# Altium schematic sheet Microcontroller.SchDoc
size A4
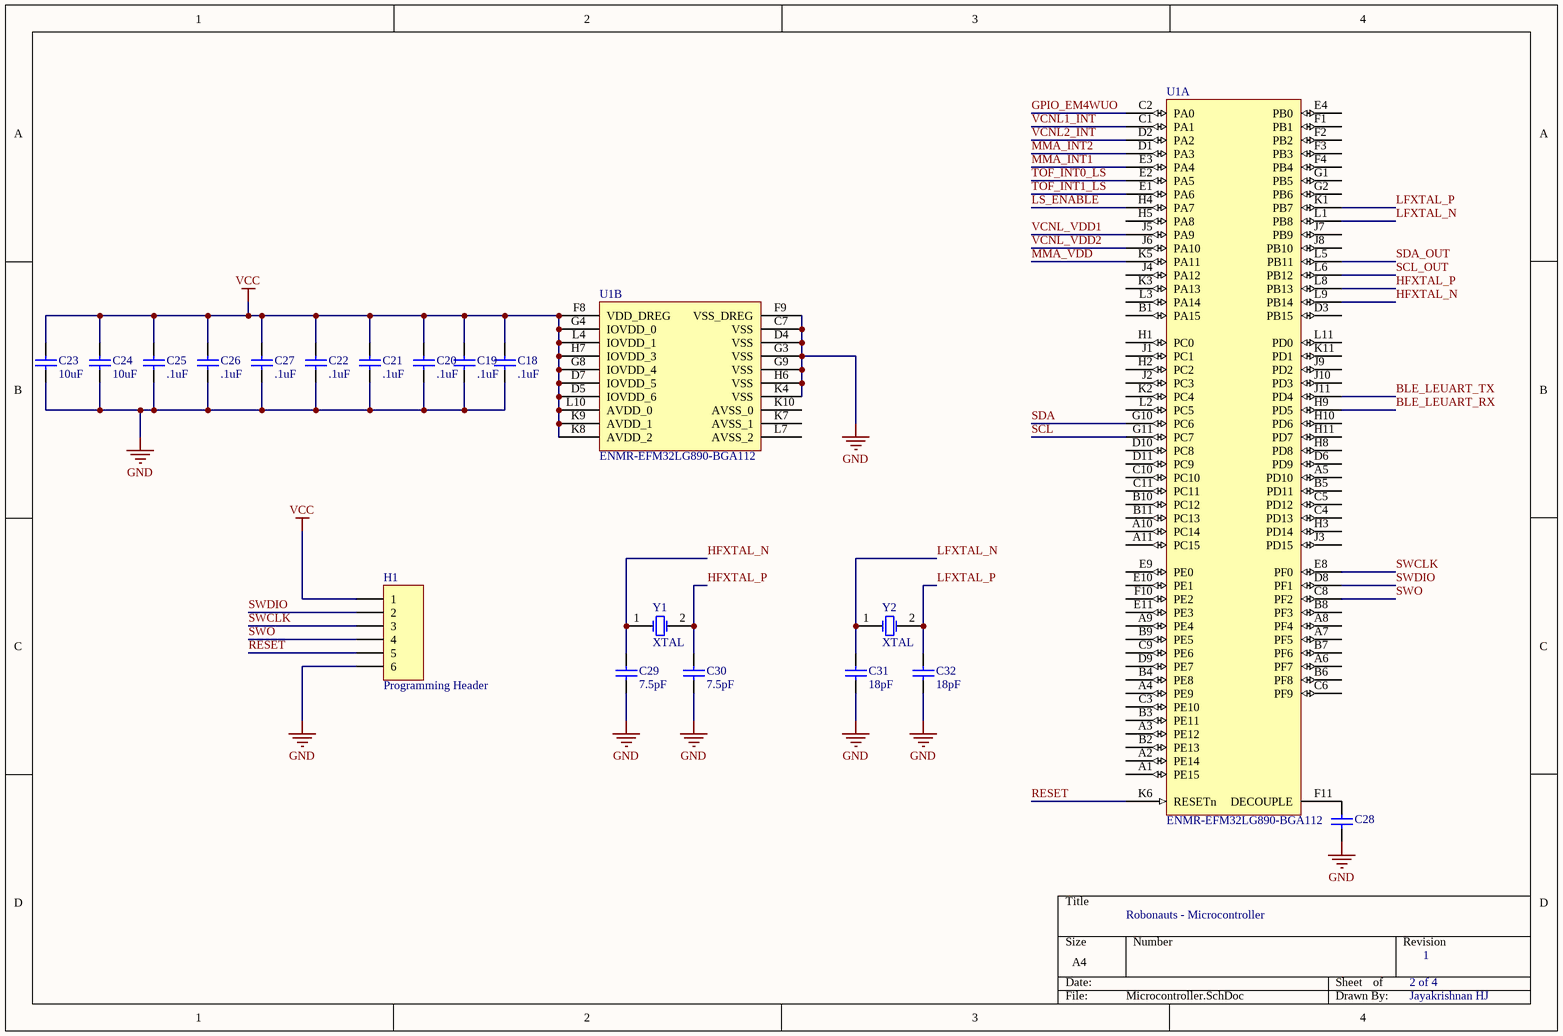
[diagram p0: Microcontroller.SchDoc]

## Parts
C18  value .1uF  [1608[0603]]  (hidden comment: Cap Semi)
C19  value .1uF  [1608[0603]]  (hidden comment: Cap Semi)
C20  value .1uF  [1608[0603]]  (hidden comment: Cap Semi)
C21  value .1uF  [1608[0603]]  (hidden comment: Cap Semi)
C22  value .1uF  [1608[0603]]  (hidden comment: Cap Semi)
C23  value 10uF  [1608[0603]]  (hidden comment: Cap Semi)
C24  value 10uF  [1608[0603]]  (hidden comment: Cap Semi)
C25  value .1uF  [1608[0603]]  (hidden comment: Cap Semi)
C26  value .1uF  [1608[0603]]  (hidden comment: Cap Semi)
C27  value .1uF  [1608[0603]]  (hidden comment: Cap Semi)
C28  Cap Semi  [1608[0603]]  (value not drawn)
C29  value 7.5pF  [C1206]  (hidden comment: Cap Semi)
C30  value 7.5pF  [C1206]  (hidden comment: Cap Semi)
C31  value 18pF  [C1206]  (hidden comment: Cap Semi)
C32  value 18pF  [C1206]  (hidden comment: Cap Semi)
H1  Programming Header  [HDR1X6]
U1  ENMR-EFM32LG890-BGA112  [ENMR-BGA112]  (parts A,B of 2)
Y1  XTAL  [R38]
Y2  XTAL  [R38]

## Nets
GND: C18.1 C19.1 C20.1 C21.1 C22.1 C23.1 C24.1 C25.1 C26.1 C27.1 C28.1 C29.1 C30.1 C31.1 C32.1 H1.6 U1.C7(VSS) U1.D4(VSS) U1.F9(VSS_DREG) U1.G3(VSS) U1.G9(VSS) U1.H6(VSS) U1.K4(VSS)
VCC: C18.2 C19.2 C20.2 C21.2 C22.2 C23.2 C24.2 C25.2 C26.2 C27.2 H1.1 U1.D5(IOVDD_6) U1.D7(IOVDD_5) U1.F8(VDD_DREG) U1.G4(IOVDD_0) U1.G8(IOVDD_4) U1.H7(IOVDD_3) U1.K8(AVDD_2) U1.K9(AVDD_1) U1.L4(IOVDD_1) U1.L10(AVDD_0)
BLE_LEUART_RX: U1.H9(PD5)
BLE_LEUART_TX: U1.J11(PD4)
GPIO_EM4WUO: U1.C2(PA0)
HFXTAL_N: C29.2 U1.L9(PB14) Y1.1(OSC1)
HFXTAL_P: C30.2 U1.L8(PB13) Y1.2(OSC2)
LFXTAL_N: C31.2 U1.L1(PB8) Y2.1(OSC1)
LFXTAL_P: C32.2 U1.K1(PB7) Y2.2(OSC2)
LS_ENABLE: U1.H4(PA7)
MMA_INT1: U1.E3(PA4)
MMA_INT2: U1.D1(PA3)
MMA_VDD: U1.K5(PA11)
RESET: H1.5 U1.K6(RESETn)
SCL: U1.G11(PC7)
SCL_OUT: U1.L6(PB12)
SDA: U1.G10(PC6)
SDA_OUT: U1.L5(PB11)
SWCLK: H1.3 U1.E8(PF0)
SWDIO: H1.2 U1.D8(PF1)
SWO: H1.4 U1.C8(PF2)
TOF_INT0_LS: U1.E2(PA5)
TOF_INT1_LS: U1.E1(PA6)
VCNL1_INT: U1.C1(PA1)
VCNL2_INT: U1.D2(PA2)
VCNL_VDD1: U1.J5(PA9)
VCNL_VDD2: U1.J6(PA10)
NetC28_2: C28.2 U1.F11(DECOUPLE)

Not connected (* = marked no-connect by the designer): U1 A1(PE15) A2(PE14) A3(PE12) A4(PE9) A5(PD10) A6(PF7) A7(PF5) A8(PF4) A9(PE4) A10(PC14) A11(PC15) B1(PA15) B2(PE13) B3(PE11) B4(PE8) B5(PD11) B6(PF8) B7(PF6) B8(PF3) B9(PE5) B10(PC12) B11(PC13) C3(PE10) C4(PD13) C5(PD12) C6(PF9) C9(PE6) C10(PC10) C11(PC11) D3(PB15) D6(PD9) D9(PE7) D10(PC8) D11(PC9) E4(PB0) E9(PE0) E10(PE1) E11(PE3) F1(PB1) F2(PB2) F3(PB3) F4(PB4) F10(PE2) G1(PB5) G2(PB6) H1(PC0) H2(PC2) H3(PD14) H5(PA8) H8(PD8) H10(PD6) H11(PD7) J1(PC1) J2(PC3) J3(PD15) J4(PA12) J7(PB9) J8(PB10) J9(PD2) J10(PD3) K2(PC4) K3(PA13) K7(AVSS_1) K10(AVSS_0) K11(PD1) L2(PC5) L3(PA14) L7(AVSS_2) L11(PD0)

## Notes on the sheet
- Robonauts - Microcontroller
- 2 of 4
- 1
- Jayakrishnan HJ

## Library data of the parts
C18-C27 C29-C32 = Cap Semi: Capacitor (Semiconductor SIM Model); Published: 8-Jun-2000; LatestRevisionDate: 29-May-2009; LatestRevisionNote: IPC-7351 Footprint Added.; PackageReference: C1206; Publisher: Altium Limited; PackageDescription: Chip Capacitor
C28 = Cap Semi: Capacitor (Semiconductor SIM Model); Value: 1uF; Published: 8-Jun-2000; LatestRevisionDate: 29-May-2009; LatestRevisionNote: IPC-7351 Footprint Added.; PackageReference: C1206; Publisher: Altium Limited; PackageDescription: Chip Capacitor
H1 = Header 6: Header, 6-Pin; LatestRevisionDate: 17-Jul-2002; LatestRevisionNote: Re-released for DXP Platform.; Publisher: Altium Limited
Y1 Y2 = XTAL: Crystal Oscillator; Published: 8-Jun-2000; LatestRevisionDate: 17-Jul-2002; LatestRevisionNote: Re-released for DXP Platform.; PackageReference: R38; Publisher: Altium Limited; PackageDescription: Crystal, Thru-Hole; 2 Leads; Body 3.1 x 8.2 mm (Dia.xH)